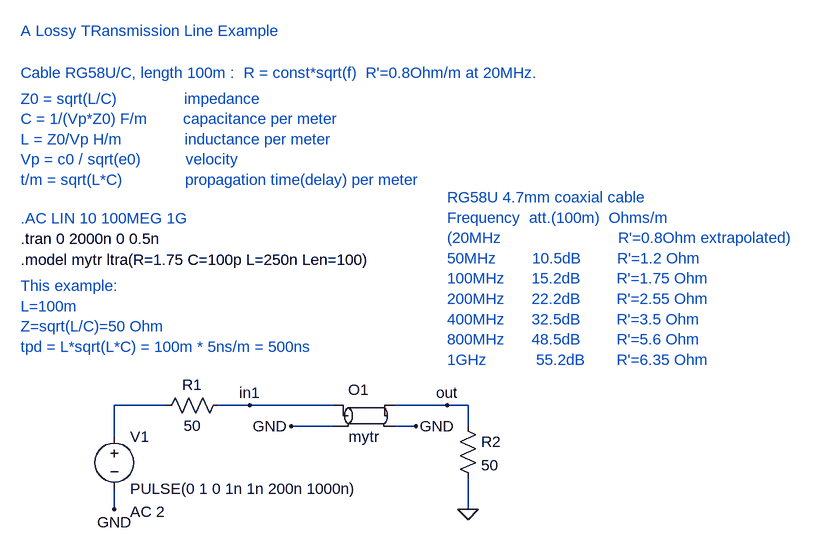
[diagram p0: schematic LossyTransmLineRG58U.asc]
LossyTransmLineRG58U.asc, the LTspice schematic file:
Version 4
SHEET 1 2544 1412
WIRE 1328 1248 1392 1248
WIRE 1488 1248 1520 1248
WIRE 1056 1216 1136 1216
WIRE 1488 1216 1568 1216
WIRE 1056 1376 1056 1344
WIRE 1056 1264 1056 1216
WIRE 1216 1216 1264 1216
WIRE 1264 1216 1392 1216
WIRE 1568 1216 1600 1216
WIRE 1600 1248 1600 1216
WIRE 1600 1328 1600 1376
FLAG 1520 1248 GND
FLAG 1328 1248 GND
FLAG 1056 1376 GND
FLAG 1264 1216 in1
FLAG 1568 1216 out
FLAG 1600 1376 0
SYMBOL LTLINE 1440 1232 R0
WINDOW 0 -24 -40 Left 0
SYMATTR InstName O1
SYMATTR Value mytr
SYMBOL VOLTAGE 1056 1248 R0
WINDOW 123 24 132 Left 0
WINDOW 39 0 0 Left 0
SYMATTR Value2 AC 2
SYMATTR InstName V1
SYMATTR Value PULSE(0 1 0 1n 1n 200n 1000n)
SYMBOL RES 1120 1232 R270
WINDOW 0 32 56 VTop 0
WINDOW 3 0 56 VBottom 0
SYMATTR InstName R1
SYMATTR Value 50
SYMBOL res 1584 1232 R0
SYMATTR InstName R2
SYMATTR Value 50
TEXT 912 960 Left 0 !.tran 0 2000n 0 0.5n
TEXT 912 992 Left 0 !.model mytr ltra(R=1.75 C=100p L=250n Len=100)
TEXT 912 928 Left 0 ;.AC LIN 10 100MEG 1G
TEXT 1568 896 Left 0 ;RG58U 4.7mm coaxial cable\nFrequency  att.(100m)  Ohms/m\n(20MHz                          R'=0.8Ohm extrapolated)\n50MHz        10.5dB        R'=1.2 Ohm\n100MHz      15.2dB        R'=1.75 Ohm\n200MHz      22.2dB        R'=2.55 Ohm\n400MHz      32.5dB        R'=3.5 Ohm\n800MHz      48.5dB        R'=5.6 Ohm\n1GHz           55.2dB       R'=6.35 Ohm
TEXT 912 744 Left 0 ;Z0 = sqrt(L/C)               impedance\nC = 1/(Vp*Z0) F/m        capacitance per meter\nL = Z0/Vp H/m              inductance per meter\nVp = c0 / sqrt(e0)          velocity\nt/m = sqrt(L*C)              propagation time(delay) per meter
TEXT 912 704 Left 0 ;Cable RG58U/C, length 100m :  R = const*sqrt(f)  R'=0.8Ohm/m at 20MHz.
TEXT 912 1032 Left 0 ;This example:\nL=100m\nZ=sqrt(L/C)=50 Ohm \ntpd = L*sqrt(L*C) = 100m * 5ns/m = 500ns
TEXT 912 640 Left 0 ;A Lossy TRansmission Line Example

The netlist it stands for:
* LossyTransmLineRG58U.asc
O1 in1 GND out GND mytr
V1 N001 GND PULSE(0 1 0 1n 1n 200n 1000n) AC 2
R1 N001 in1 50
R2 out 0 50
.tran 0 2000n 0 0.5n
.model mytr ltra(R=1.75 C=100p L=250n Len=100)
* .AC LIN 10 100MEG 1G
* RG58U 4.7mm coaxial cable
* Frequency  att.(100m)  Ohms/m
* (20MHz                          R'=0.8Ohm extrapolated)
* 50MHz        10.5dB        R'=1.2 Ohm
* 100MHz      15.2dB        R'=1.75 Ohm
* 200MHz      22.2dB        R'=2.55 Ohm
* 400MHz      32.5dB        R'=3.5 Ohm
* 800MHz      48.5dB        R'=5.6 Ohm
* 1GHz           55.2dB       R'=6.35 Ohm
* Z0 = sqrt(L/C)               impedance
* C = 1/(Vp*Z0) F/m        capacitance per meter
* L = Z0/Vp H/m              inductance per meter
* Vp = c0 / sqrt(e0)          velocity
* t/m = sqrt(L*C)              propagation time(delay) per meter
* Cable RG58U/C, length 100m :  R = const*sqrt(f)  R'=0.8Ohm/m at 20MHz.
* This example:
* L=100m
* Z=sqrt(L/C)=50 Ohm
* tpd = L*sqrt(L*C) = 100m * 5ns/m = 500ns
* A Lossy TRansmission Line Example
.backanno
.end